# EAGLE design Schit (EAGLE 6.4)
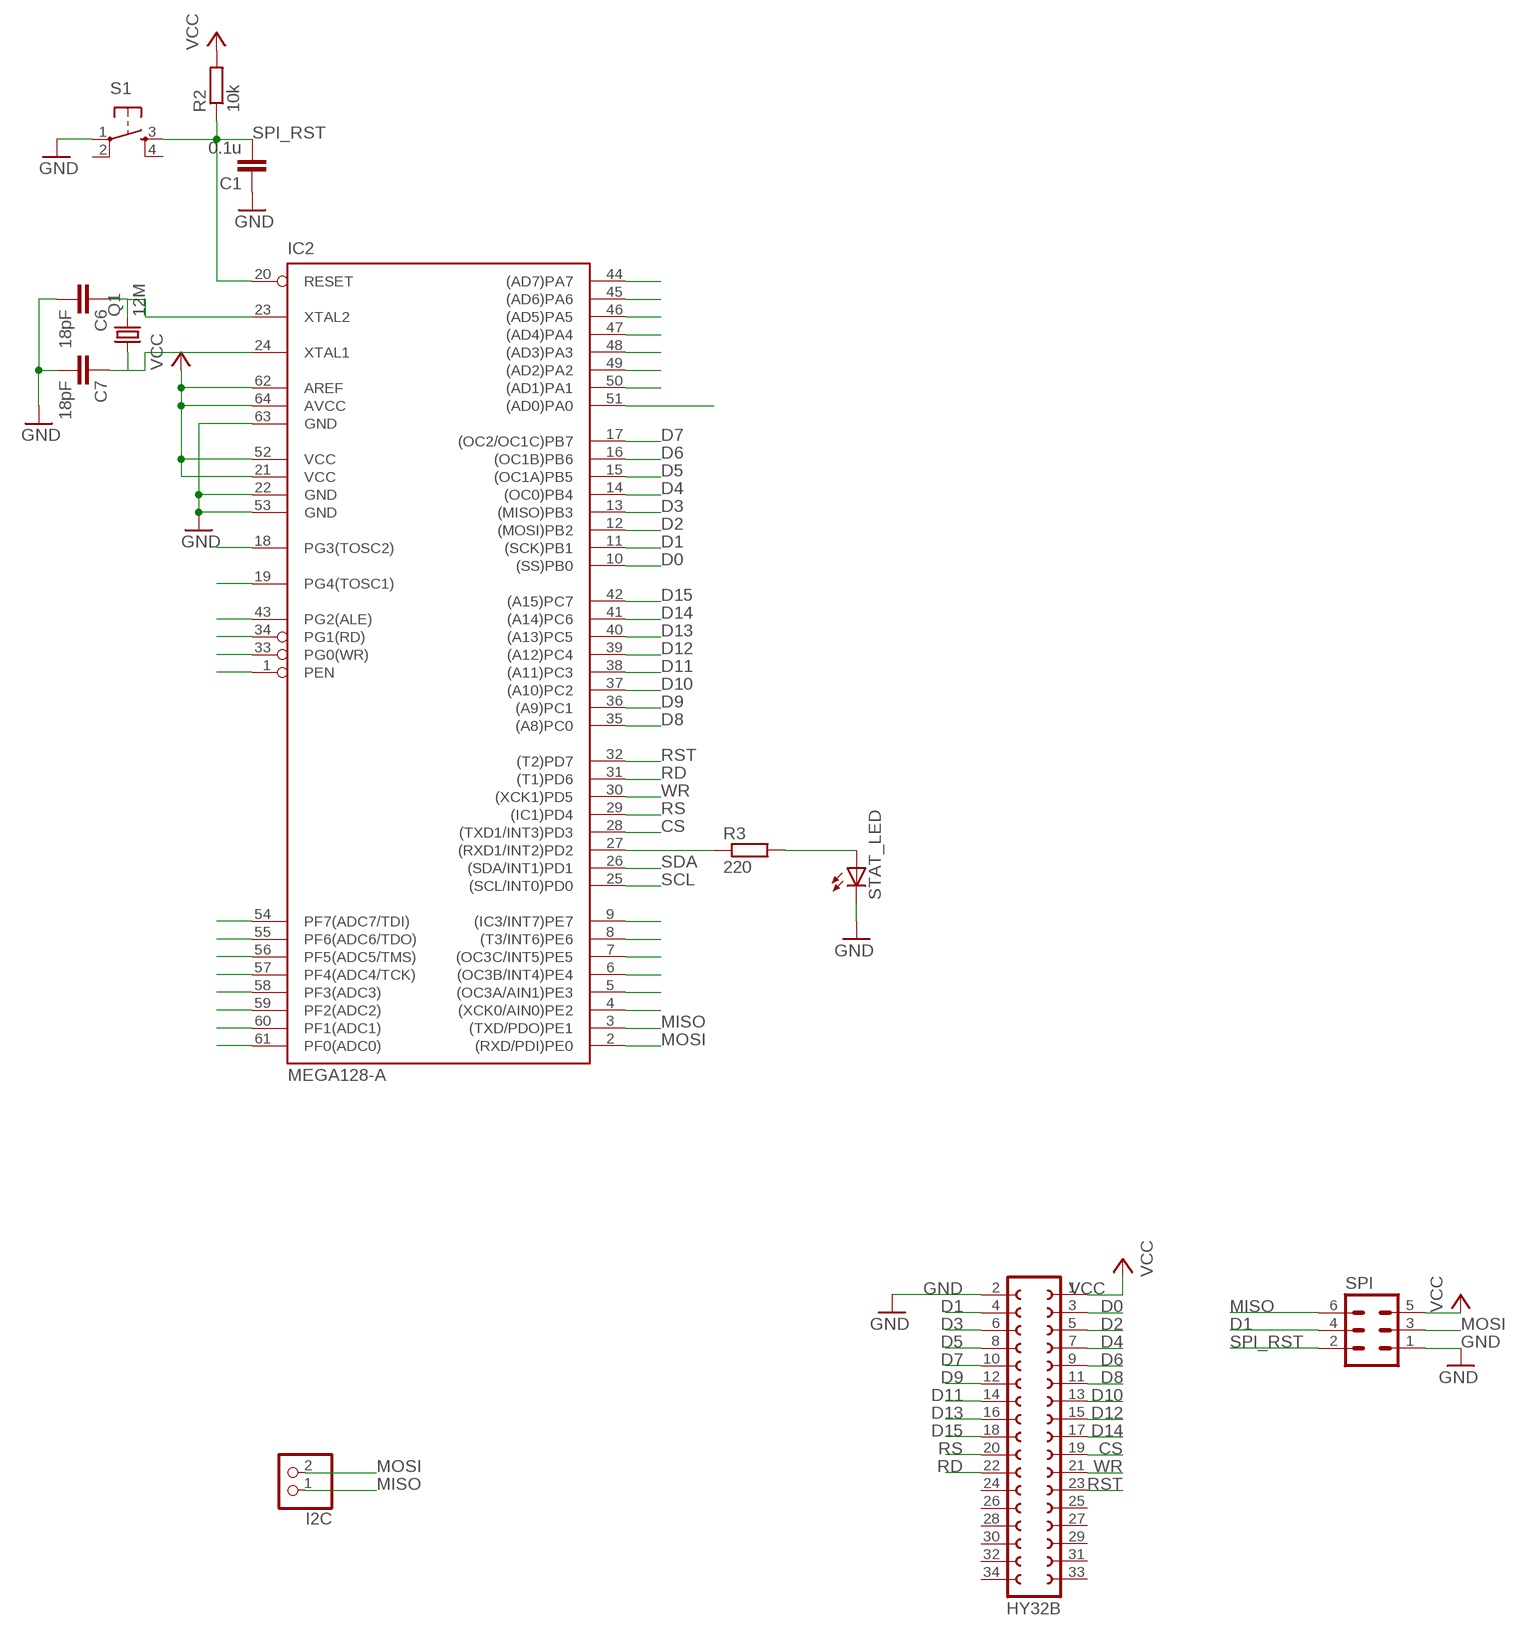
[diagram p0: schematic, sheet 1]

## Parts
C1  0.1u  C-EUC0805  [C0805]
C6  18pF  C-EUC0805  [C0805]
C7  18pF  C-EUC0805  [C0805]
HY32B  FE17-2  [FE17-2]
I2C  PINHD-1X2  [1X02]
IC2  MEGA128-A  [TQFP64]
Q1  12M  CRYSTALHC49S  [HC49/S]
R2  10k  R-EU_R0805  [R0805]
R3  220  R-EU_M2012  [M2012]
S1  TAC_SWITCHSMD  [TACTILE_SWITCH_SMD]
SPI  ML6  [ML6]
STAT_LED  LED3MM  [LED3MM]

## Nets
CS: HY32B.19 IC2.28((TXD1/INT3)PD3)
D0: HY32B.3 IC2.10((SS)PB0)
D1: HY32B.4 IC2.11((SCK)PB1) SPI.4
D2: HY32B.5 IC2.12((MOSI)PB2)
D3: HY32B.6 IC2.13((MISO)PB3)
D4: HY32B.7 IC2.14((OC0)PB4)
D5: HY32B.8 IC2.15((OC1A)PB5)
D6: HY32B.9 IC2.16((OC1B)PB6)
D7: HY32B.10 IC2.17((OC2/OC1C)PB7)
D8: HY32B.11 IC2.35((A8)PC0)
D9: HY32B.12 IC2.36((A9)PC1)
D10: HY32B.13 IC2.37((A10)PC2)
D11: HY32B.14 IC2.38((A11)PC3)
D12: HY32B.15 IC2.39((A12)PC4)
D13: HY32B.16 IC2.40((A13)PC5)
D14: HY32B.17 IC2.41((A14)PC6)
D15: HY32B.18 IC2.42((A15)PC7)
GND: C1.1 C6.2 C7.2 HY32B.2 IC2.22(GND) IC2.53(GND) IC2.63(GND) S1.1 SPI.1 STAT_LED.K(C)
MISO: I2C.1 IC2.3((TXD/PDO)PE1) SPI.6
MOSI: I2C.2 IC2.2((RXD/PDI)PE0) SPI.3
N$1: IC2.27((RXD1/INT2)PD2) R3.1
N$9: R3.2 STAT_LED.A
N$23: IC2.4((XCK0/AIN0)PE2)
N$24: IC2.5((OC3A/AIN1)PE3)
N$25: IC2.6((OC3B/INT4)PE4)
N$26: IC2.7((OC3C/INT5)PE5)
N$27: IC2.8((T3/INT6)PE6)
N$28: IC2.9((IC3/INT7)PE7)
N$29: C7.1 IC2.24(XTAL1) Q1.1
N$30: C6.1 IC2.23(XTAL2) Q1.2
N$54: IC2.51((AD0)PA0)
N$55: IC2.50((AD1)PA1)
N$56: IC2.49((AD2)PA2)
N$57: IC2.48((AD3)PA3)
N$58: IC2.47((AD4)PA4)
N$59: IC2.46((AD5)PA5)
N$60: IC2.45((AD6)PA6)
N$61: IC2.44((AD7)PA7)
N$72: IC2.18(PG3(TOSC2))
N$73: IC2.19(PG4(TOSC1))
N$74: IC2.43(PG2(ALE))
N$75: IC2.34(PG1(RD))
N$76: IC2.33(PG0(WR))
N$77: IC2.1(PEN)
N$78: IC2.54(PF7(ADC7/TDI))
N$79: IC2.55(PF6(ADC6/TDO))
N$80: IC2.56(PF5(ADC5/TMS))
N$81: IC2.57(PF4(ADC4/TCK))
N$82: IC2.58(PF3(ADC3))
N$83: IC2.59(PF2(ADC2))
N$84: IC2.60(PF1(ADC1))
N$85: IC2.61(PF0(ADC0))
RD: HY32B.22 IC2.31((T1)PD6)
RS: HY32B.20 IC2.29((IC1)PD4)
RST: HY32B.23 IC2.32((T2)PD7)
SCL: IC2.25((SCL/INT0)PD0)
SDA: IC2.26((SDA/INT1)PD1)
SPI_RST: C1.2 IC2.20(RESET) R2.1 S1.3 SPI.2
VCC: HY32B.1 IC2.21(VCC) IC2.52(VCC) IC2.62(AREF) IC2.64(AVCC) R2.2 SPI.5
WR: HY32B.21 IC2.30((XCK1)PD5)
Unconnected: HY32B.24 HY32B.25 HY32B.26 HY32B.27 HY32B.28 HY32B.29 HY32B.30 HY32B.31 HY32B.32 HY32B.33 HY32B.34 S1.2 S1.4

## Library data of the parts
C1 C6 C7 = rcl:C-EU: CAPACITOR, European symbol
HY32B = con-lsta:FE17-2: FEMALE HEADER; OC_FARNELL: unknown; OC_NEWARK: unknown
I2C = pinhead:PINHD-1X2: PIN HEADER
IC2 = atmel:MEGA128: MICROCONTROLLER 128 Kbytes FLASH 4 Kbytes SRAM 4 Kbytes EEPROM DUAL USART 8-channel 10 bit ADC Source: avr.lbr; MPN: ATMEGA128-16AU; OC_FARNELL: 9171118; OC_NEWARK: 95K7364
Q1 = crystal:CRYSTAL: CRYSTAL; OC_FARNELL: 1667008; OC_NEWARK: unknown
R2 R3 = rcl:R-EU_: RESISTOR, European symbol
S1 = SparkFun-Electromechanical:TAC_SWITCH: Momentary Switch Button commonly used for reset or general input. Spark Fun Electronics SKU : COM-00097 SMT- SWCH-08247; PROD_ID: SWCH-08247
SPI = con-harting-ml:ML6: HARTING; OC_FARNELL: unknown; OC_NEWARK: unknown
STAT_LED = led:LED: LED OSRAM: - CHIPLED LG R971, LG N971, LY N971, LG Q971, LY Q971, LO R971, LY R971 LH N974, LH R974 LS Q976, LO Q976, LY Q976 LO Q996 - Hyper CHIPLED LW Q18S LB Q993, LB Q99A, LB R99A - SideLED LS A670, LO A670, LY A670, LG A670, LP A670 LB A673, LV A673, LT A673, LW A673 LH A674 LY A675 LS A676, LA A676, LO A676, LY A676, LW A676 LS A679, LY A679, LG A679 - Hyper Micro SIDELED® LS Y876, LA Y876, LO Y876, LY Y876 LT Y87S - SmartLED LW L88C, LW L88S LB L89C, LB L89S, LG L890 LS L89K, LO L89K, LY L89K LS L896, LA L896, LO L896, LY L896 - TOPLED LS T670, LO T670, LY T670, LG T670, LP T670 LSG T670, LSP T670, LSY T670, LOP T670, LYG T670 LG T671, LOG T671, LSG T671 LB T673, LV T673, LT T673, LW T673 LH T674 LS T676, LA T676, LO T676, LY T676, LB T676, LH T676, LSB T676, LW T676 LB T67C, LV T67C, LT T67C, LS T67K, LO T67K, LY T67K, LW E67C LS E67B, LA E67B, LO E67B, LY E67B, LB E67C, LV E67C, LT E67C LW T67C LS T679, LY T679, LG T679 LS T770, LO T770, LY T770, LG T770, LP T770 LB T773, LV T773, LT T773, LW T773 LH T774 LS E675, LA E675, LY E675, LS T675 LS T776, LA T776, LO T776, LY T776, LB T776 LHGB T686 LT T68C, LB T68C - Hyper Mini TOPLED® LB M676 - Mini TOPLED Santana® LG M470 LS M47K, LO M47K, LY M47K Source: http://www.osram.convergy.de LUXEON: - LUMILED® LXK2-PW12-R00, LXK2-PW12-S00, LXK2-PW14-U00, LXK2-PW14-V00 LXK2-PM12-R00, LXK2-PM12-S00, LXK2-PM14-U00 LXK2-PE12-Q00, LXK2-PE12-R00, LXK2-PE12-S00, LXK2-PE14-T00, LXK2-PE14-U00 LXK2-PB12-K00, LXK2-PB12-L00, LXK2-PB12-M00, LXK2-PB14-N00, LXK2-PB14-P00, LXK2-PB14-Q00 LXK2-PR12-L00, LXK2-PR12-M00, LXK2-PR14-Q00, LXK2-PR14-R00 LXK2-PD12-Q00, LXK2-PD12-R00, LXK2-PD12-S00 LXK2-PH12-R00, LXK2-PH12-S00 LXK2-PL12-P00, LXK2-PL12-Q00, LXK2-PL12-R00 Source: www.luxeon.com KINGBRIGHT: KA-3528ASYC Source: www.kingbright.com

## Board
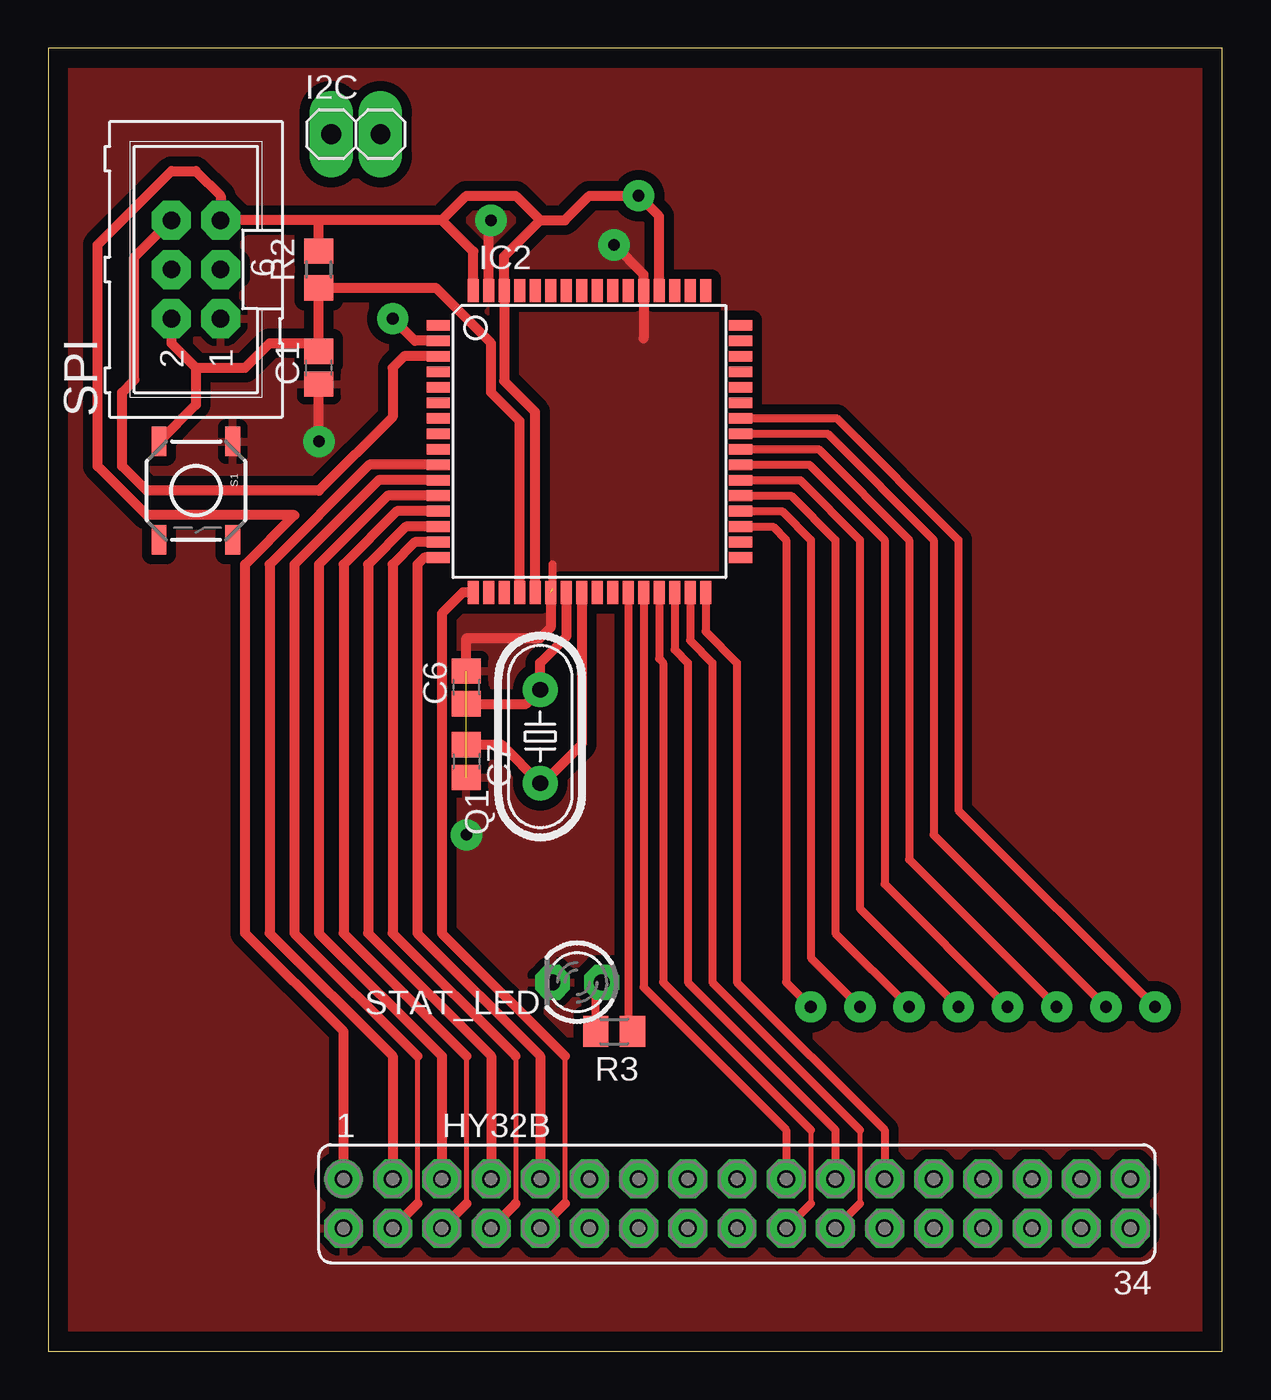
[diagram p1: board, top side]
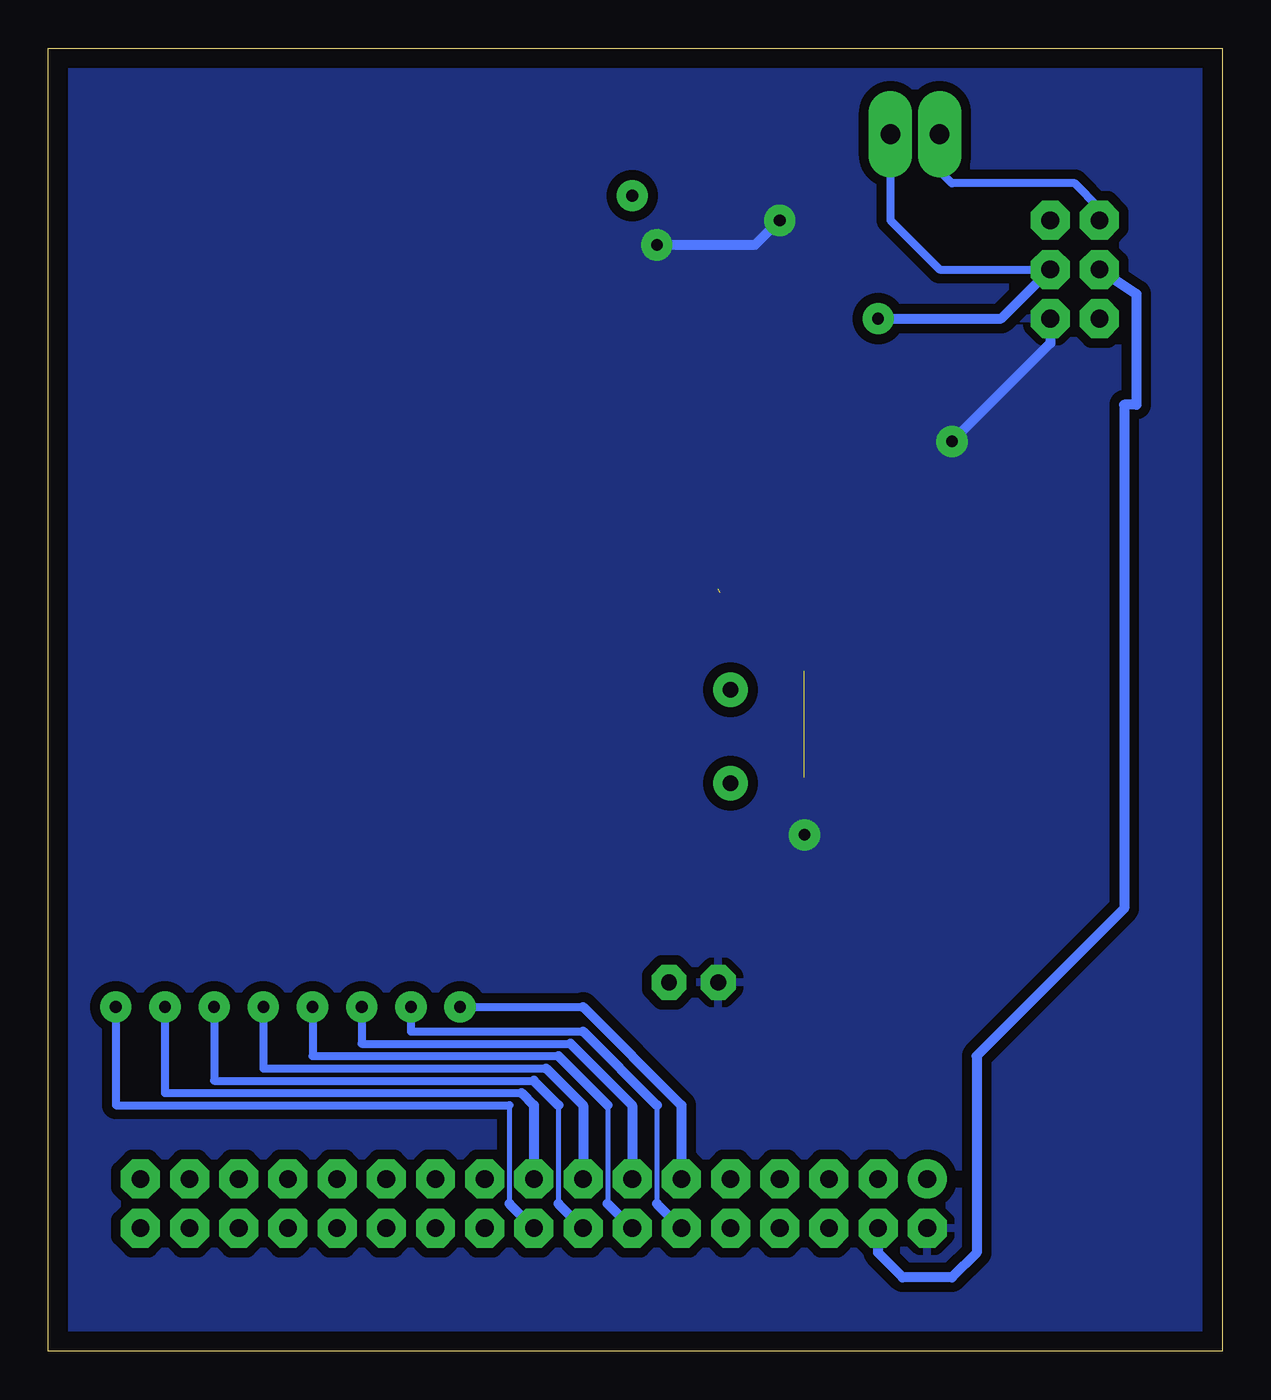
[diagram p2: board, bottom side, seen from below]

Size 60.63 x 67.3 mm. Coordinates in mm from the lower left corner, seen from the top.
Outline: 0,0 60.63,0 60.63,67.3 0,67.3 0,0
Copper layers (1*16): Top 0.035mm / dielectric 1.5mm / Bottom 0.035mm
Design rules "default *": minimum track width 10mil, minimum drill 20mil, track to track 20mil, track to pad 15mil, pad to pad 158mil, via to via 10mil, smd to smd 8mil, copper to edge 40mil, drill to drill 8mil, minimum pad ring 10mil, minimum via ring 8mil, stop-mask expansion 4mil, vias tented up to drill 0mil, thermal gap 15mil

### Footprints (pad centres in the part's own frame; a part is rotated, then mirrored left to right if it is on the bottom)
C0805 = smd 1.3 x 1.5: 1 -0.85,0; 2 0.85,0
FE17-2 = drill 0.914: 1 -20.32,1.27 | drill 0.914 octagon: 2 -20.32,-1.27; 3 -17.78,1.27; 4 -17.78,-1.27; 5 -15.24,1.27; 6 -15.24,-1.27; 7 -12.7,1.27; 8 -12.7,-1.27; 9 -10.16,1.27; 10 -10.16,-1.27; 11 -7.62,1.27; 12 -7.62,-1.27; 13 -5.08,1.27; 14 -5.08,-1.27; 15 -2.54,1.27; 16 -2.54,-1.27; 17 0,1.27; 18 0,-1.27; 19 2.54,1.27; 20 2.54,-1.27; 21 5.08,1.27; 22 5.08,-1.27; 23 7.62,1.27; 24 7.62,-1.27; 25 10.16,1.27; 26 10.16,-1.27; 27 12.7,1.27; 28 12.7,-1.27; 29 15.24,1.27; 30 15.24,-1.27; 31 17.78,1.27; 32 17.78,-1.27; 33 20.32,1.27; 34 20.32,-1.27
1X02 = drill 1.016 long: 1 -1.27,0; 2 1.27,0
TQFP64 = smd 1.194 x 0.559: 1 -7.8,6; 2 -7.8,5.2; 3 -7.8,4.4; 4 -7.8,3.6; 5 -7.8,2.8; 6 -7.8,2; 7 -7.8,1.2; 8 -7.8,0.4; 9 -7.8,-0.4; 10 -7.8,-1.2; 11 -7.8,-2; 12 -7.8,-2.8; 13 -7.8,-3.6; 14 -7.8,-4.4; 15 -7.8,-5.2; 16 -7.8,-6; 33 7.8,-6; 34 7.8,-5.2; 35 7.8,-4.4; 36 7.8,-3.6; 37 7.8,-2.8; 38 7.8,-2; 39 7.8,-1.2; 40 7.8,-0.4; 41 7.8,0.4; 42 7.8,1.2; 43 7.8,2; 44 7.8,2.8; 45 7.8,3.6; 46 7.8,4.4; 47 7.8,5.2; 48 7.8,6 | smd 0.559 x 1.194: 17 -6,-7.8; 18 -5.2,-7.8; 19 -4.4,-7.8; 20 -3.6,-7.8; 21 -2.8,-7.8; 22 -2,-7.8; 23 -1.2,-7.8; 24 -0.4,-7.8; 25 0.4,-7.8; 26 1.2,-7.8; 27 2,-7.8; 28 2.8,-7.8; 29 3.6,-7.8; 30 4.4,-7.8; 31 5.2,-7.8; 32 6,-7.8; 49 6,7.8; 50 5.2,7.8; 51 4.4,7.8; 52 3.6,7.8; 53 2.8,7.8; 54 2,7.8; 55 1.2,7.8; 56 0.4,7.8; 57 -0.4,7.8; 58 -1.2,7.8; 59 -2,7.8; 60 -2.8,7.8; 61 -3.6,7.8; 62 -4.4,7.8; 63 -5.2,7.8; 64 -6,7.8
HC49/S = drill 0.813: 1 -2.413,0; 2 2.413,0
R0805 = smd 1.3 x 1.5: 1 -0.95,0; 2 0.95,0
M2012 = smd 1.3 x 1.6: 1 -0.95,0; 2 0.95,0
TACTILE_SWITCH_SMD = smd 1.524 x 0.762: 1 -2.54,1.905; 2 2.54,1.905; 3 -2.54,-1.905; 4 2.54,-1.905
ML6 = drill 0.914 octagon: 1 -2.54,-1.27; 2 -2.54,1.27; 3 0,-1.27; 4 0,1.27; 5 2.54,-1.27; 6 2.54,1.27
LED3MM = drill 0.813 octagon: A -1.27,0; K 1.27,0

### Placement (x,y rotation side)
C1  13.97,50.8 90 top
C6  21.59,34.29 90 top
C7  21.59,30.48 270 top
HY32B  35.56,7.62 0 top
I2C  15.88,62.87 0 top
IC2  27.94,46.99 0 top
Q1  25.4,31.75 90 top
R2  13.97,55.88 90 top
R3  29.21,16.51 180 top
S1  7.62,44.45 270 top
SPI  7.62,55.88 90 top
STAT_LED  27.3,19.05 180 top

### Tracks (layer width: path | path; a pad name or v marks a point on that pad's centre or on a via)
CS
  Top 0.406: IC2.28 30.74,18.79 38.1,11.43 HY32B.19
D0
  Top 0.508: IC2.10 16.58,45.79 11.43,40.64 11.43,21.59 17.78,15.24 HY32B.3
D1
  Top 0.254: 19.05,15.24 19.05,7.62
  Top 0.508: IC2.11 17.05,44.99 12.7,40.64 12.7,21.59 19.05,15.24 | 19.05,7.62 HY32B.4
  Bottom 0.508: SPI.4 4.45,54.61 4.45,48.9 5.08,48.9 5.08,22.86 12.7,15.24 12.7,5.08 13.97,3.81 16.51,3.81 17.78,5.08 HY32B.4
D2
  Top 0.508: IC2.12 17.52,44.19 13.97,40.64 13.97,21.59 20.32,15.24 HY32B.5
D3
  Top 0.254: 21.59,15.24 21.59,7.62
  Top 0.508: IC2.13 17.99,43.39 15.24,40.64 15.24,21.59 21.59,15.24 | 21.59,7.62 HY32B.6
D4
  Top 0.508: IC2.14 18.46,42.59 16.51,40.64 16.51,21.59 22.86,15.24 HY32B.7
D5
  Top 0.254: 24.13,15.24 24.13,7.62
  Top 0.508: IC2.15 18.93,41.79 17.78,40.64 17.78,21.59 24.13,15.24 | 24.13,7.62 HY32B.8
D6
  Top 0.508: IC2.16 19.4,40.99 19.05,40.64 19.05,21.59 25.4,15.24 HY32B.9
D7
  Top 0.254: 26.67,15.24 26.67,7.62
  Top 0.508: IC2.17 21.41,39.19 20.32,38.1 20.32,21.59 26.67,15.24 | 26.67,7.62 HY32B.10
D8  (via drill 0.6)
  Top 0.406: IC2.35 37.42,42.59 38.1,41.91 38.1,19.05 v39.37,17.78
  Bottom 0.406: v39.37,17.78 33.02,17.78
  Bottom 0.508: 33.02,17.78 27.94,12.7 HY32B.11
D9  (via drill 0.6)
  Top 0.406: IC2.36 37.89,43.39 39.37,41.91 39.37,20.32 v41.91,17.78
  Bottom 0.254: 29.21,12.7 29.21,7.62
  Bottom 0.406: v41.91,17.78 41.91,16.51 33.02,16.51
  Bottom 0.508: 33.02,16.51 29.21,12.7 | 29.21,7.62 HY32B.12
D10  (via drill 0.6)
  Top 0.406: IC2.37 38.36,44.19 40.64,41.91 40.64,21.59 v44.45,17.78
  Bottom 0.406: v44.45,17.78 44.45,15.88 33.66,15.88
  Bottom 0.508: 33.66,15.88 30.48,12.7 HY32B.13
D11  (via drill 0.6)
  Top 0.406: IC2.38 38.83,44.99 41.91,41.91 41.91,22.86 v46.99,17.78
  Bottom 0.254: 31.75,12.7 31.75,7.62
  Bottom 0.406: v46.99,17.78 46.99,15.24 34.29,15.24
  Bottom 0.508: 34.29,15.24 31.75,12.7 | 31.75,7.62 HY32B.14
D12  (via drill 0.6)
  Top 0.406: IC2.39 39.3,45.79 43.18,41.91 43.18,24.13 v49.53,17.78
  Bottom 0.406: v49.53,17.78 49.53,14.61 34.92,14.61
  Bottom 0.508: 34.92,14.61 33.02,12.7 HY32B.15
D13  (via drill 0.6)
  Top 0.406: IC2.40 39.77,46.59 44.45,41.91 44.45,25.4 v52.07,17.78
  Bottom 0.254: 34.29,12.7 34.29,7.62
  Bottom 0.406: v52.07,17.78 52.07,13.97 35.56,13.97
  Bottom 0.508: 35.56,13.97 34.29,12.7 | 34.29,7.62 HY32B.16
D14  (via drill 0.6)
  Top 0.406: IC2.41 40.24,47.39 45.72,41.91 45.72,26.67 v54.61,17.78
  Bottom 0.406: v54.61,17.78 54.61,13.34 36.2,13.34
  Bottom 0.508: 36.2,13.34 35.56,12.7 HY32B.17
D15  (via drill 0.6)
  Top 0.406: IC2.42 40.71,48.19 46.99,41.91 46.99,27.94 v57.15,17.78
  Bottom 0.254: 36.83,12.7 36.83,7.62
  Bottom 0.406: v57.15,17.78 57.15,12.7 36.83,12.7
  Bottom 0.508: 36.83,7.62 HY32B.18
GND  (via drill 0.6)  (2 unrouted)
  Top 0.406: 26.04,39.37 26.04,40.64
  Top 0.508: v13.97,46.99 C1.1 | IC2.63 22.74,58.3 v22.86,58.42 | v29.21,57.15 30.74,55.62 IC2.53 30.74,52.33 | C6.2 21.59,36.83 25.4,36.83 25.94,37.37 IC2.22
  Bottom 0.508: SPI.1 8.89,52.07 v13.97,46.99 | v29.21,57.15 24.13,57.15 v22.86,58.42
  other vias: 21.59,26.67
  pour Top: 0,0 60.33,0 60.33,67.31 0,67.31
  pour Bottom: 0,0 60.33,0 60.33,67.31 0,67.31
MISO
  Top 0.508: IC2.3 18.37,51.39 17.78,50.8 17.78,48.26 13.97,44.45 5.08,44.45 3.81,45.72 3.81,49.53 4.45,50.16 4.45,56.52 SPI.6
  Bottom 0.406: SPI.6 6.35,59.05 7.62,60.33 13.97,60.33 14.61,60.96 I2C.1
MOSI  (via drill 0.6)
  Top 0.508: IC2.2 18.93,52.19 v17.78,53.34
  Bottom 0.406: I2C.2 17.14,58.42 14.61,55.88 SPI.3
  Bottom 0.508: v17.78,53.34 11.43,53.34 SPI.3
N$1
  Top 0.406: IC2.27 29.94,16.73 R3.1
N$9
  Top 0.406: R3.2 28.26,18.73 STAT_LED.A
N$29
  Top 0.508: IC2.24 27.54,31.35 25.53,29.34 Q1.1 23.41,31.33 C7.1
N$30
  Top 0.508: IC2.23 26.74,36.9 25.4,35.56 Q1.2 24.68,33.44 C6.1
RD
  Top 0.254: 41.91,11.43 41.91,7.62
  Top 0.406: IC2.31 33.14,36.71 34.29,35.56 34.29,19.05 41.91,11.43 | 41.91,7.62 HY32B.22
RS
  Top 0.254: 39.37,11.43 39.37,7.62
  Top 0.406: IC2.29 31.54,35.77 31.75,35.56 31.75,19.05 39.37,11.43 | 39.37,7.62 HY32B.20
RST
  Top 0.406: IC2.32 33.94,37.18 35.56,35.56 35.56,19.05 43.18,11.43 HY32B.23
SPI_RST
  Top 0.508: IC2.20 24.34,48.05 22.86,49.53 22.86,52.07 20,54.93 R2.1 C1.2 13.55,52.07 11.43,52.07 10.16,50.8 7.62,50.8 | SPI.2 6.35,52.07 7.62,50.8 | 7.62,50.8 7.62,48.9 S1.3
VCC  (via drill 0.6)
  Top 0.508: IC2.21 25.14,48.52 23.54,50.12 IC2.62 23.54,56.56 25.4,58.42 | 20.32,58.42 13.97,58.42 | 13.97,58.42 SPI.5 8.89,59.69 7.62,60.96 6.35,60.96 2.54,57.15 2.54,45.72 5.08,43.18 12.7,43.18 10.16,40.64 10.16,21.59 15.24,16.51 HY32B.1 | R2.2 13.97,58.42 | IC2.64 21.94,56.8 20.32,58.42 | 20.32,58.42 21.59,59.69 24.13,59.69 25.4,58.42 | IC2.52 31.54,58.63 v30.48,59.69 27.94,59.69 26.67,58.42 25.4,58.42
WR
  Top 0.406: IC2.30 32.34,36.24 33.02,35.56 33.02,19.05 40.64,11.43 HY32B.21